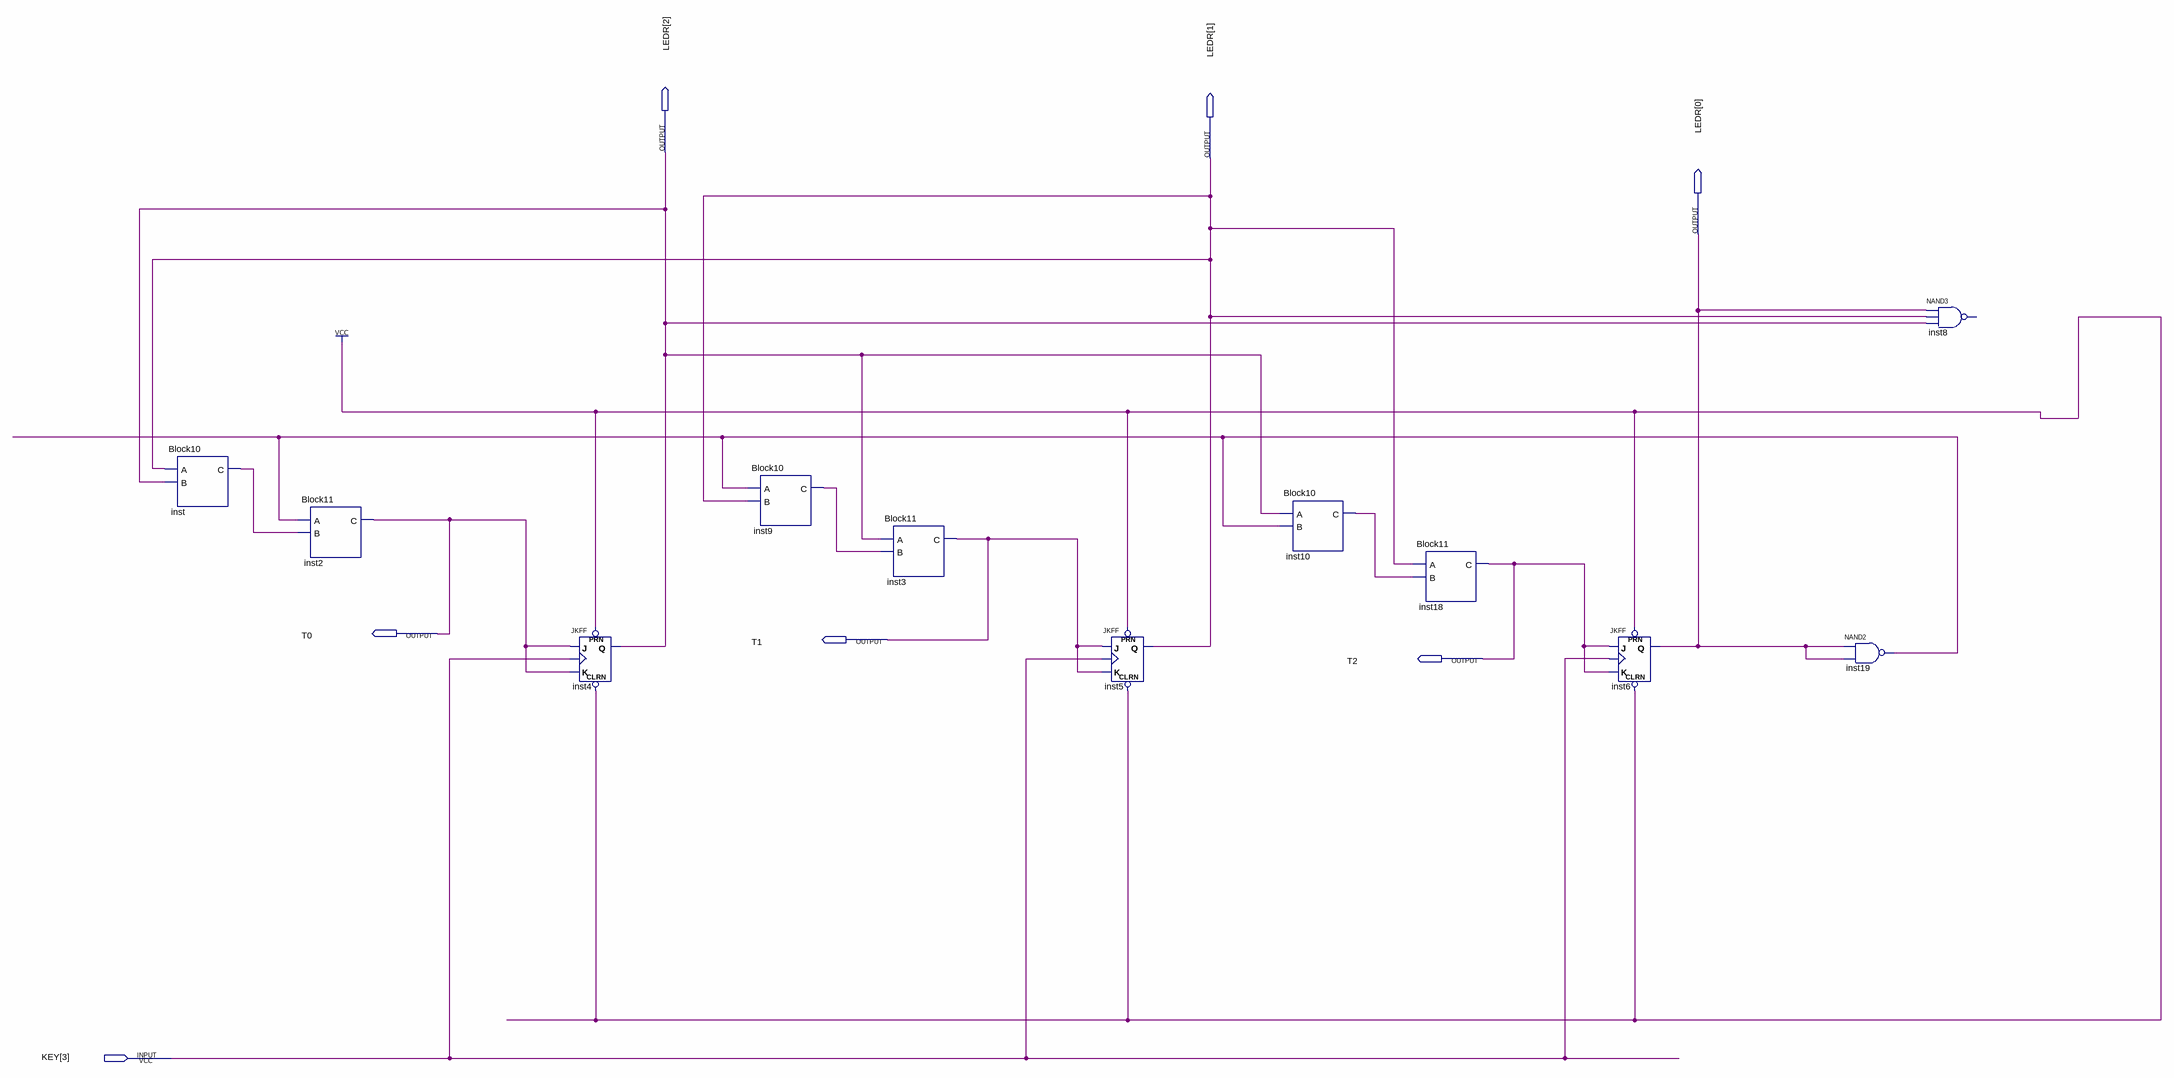
[diagram p0: schematic sheet]
// Quartus schematic Block12.bdf as structural Verilog: 11 symbols, 7 pins
module Block12 (
  input  [3:3] KEY,
  output [2:0] LEDR,
  output T0,
  output T1,
  output T2
);

  wire inst9_c, inst10_c, inst19_out, inst_c;

  Block10 inst (.A(LEDR[1]), .B(LEDR[2]), .C(inst_c));
  Block11 inst2 (.A(inst19_out), .B(inst_c), .C(T0));
  JKFF inst4 (.PRN(1'b1), .CLRN(1'b1), .K(T0), .J(T0), .CLK(KEY[3]), .Q(LEDR[2]));
  Block10 inst9 (.A(inst19_out), .B(LEDR[1]), .C(inst9_c));
  Block11 inst3 (.A(LEDR[2]), .B(inst9_c), .C(T1));
  JKFF inst5 (.PRN(1'b1), .CLRN(1'b1), .K(T1), .J(T1), .CLK(KEY[3]), .Q(LEDR[1]));
  Block10 inst10 (.A(LEDR[2]), .B(inst19_out), .C(inst10_c));
  Block11 inst18 (.A(LEDR[1]), .B(inst10_c), .C(T2));
  JKFF inst6 (.PRN(1'b1), .CLRN(1'b1), .K(T2), .J(T2), .CLK(KEY[3]), .Q(LEDR[0]));
  nand inst19 (inst19_out, LEDR[0], LEDR[0]);
  // NAND3 inst8 has open pins: IN1=LEDR[0], IN2=LEDR[1], IN3=LEDR[2], OUT=open
endmodule
